# EasyEDA Pro project ProPrj_Tuya AC Sensor_2025-06-06.epro

# Schematic Schematic1
Board Name: Board1; Create Date: 2025-06-05; Page Name: P1; Project Name: Tuya AC Sensor; Schematic Name: Schematic1; Update Date: 2025-06-05; Company: EasyEDA.com; Page Size: A4; Version: V1.0
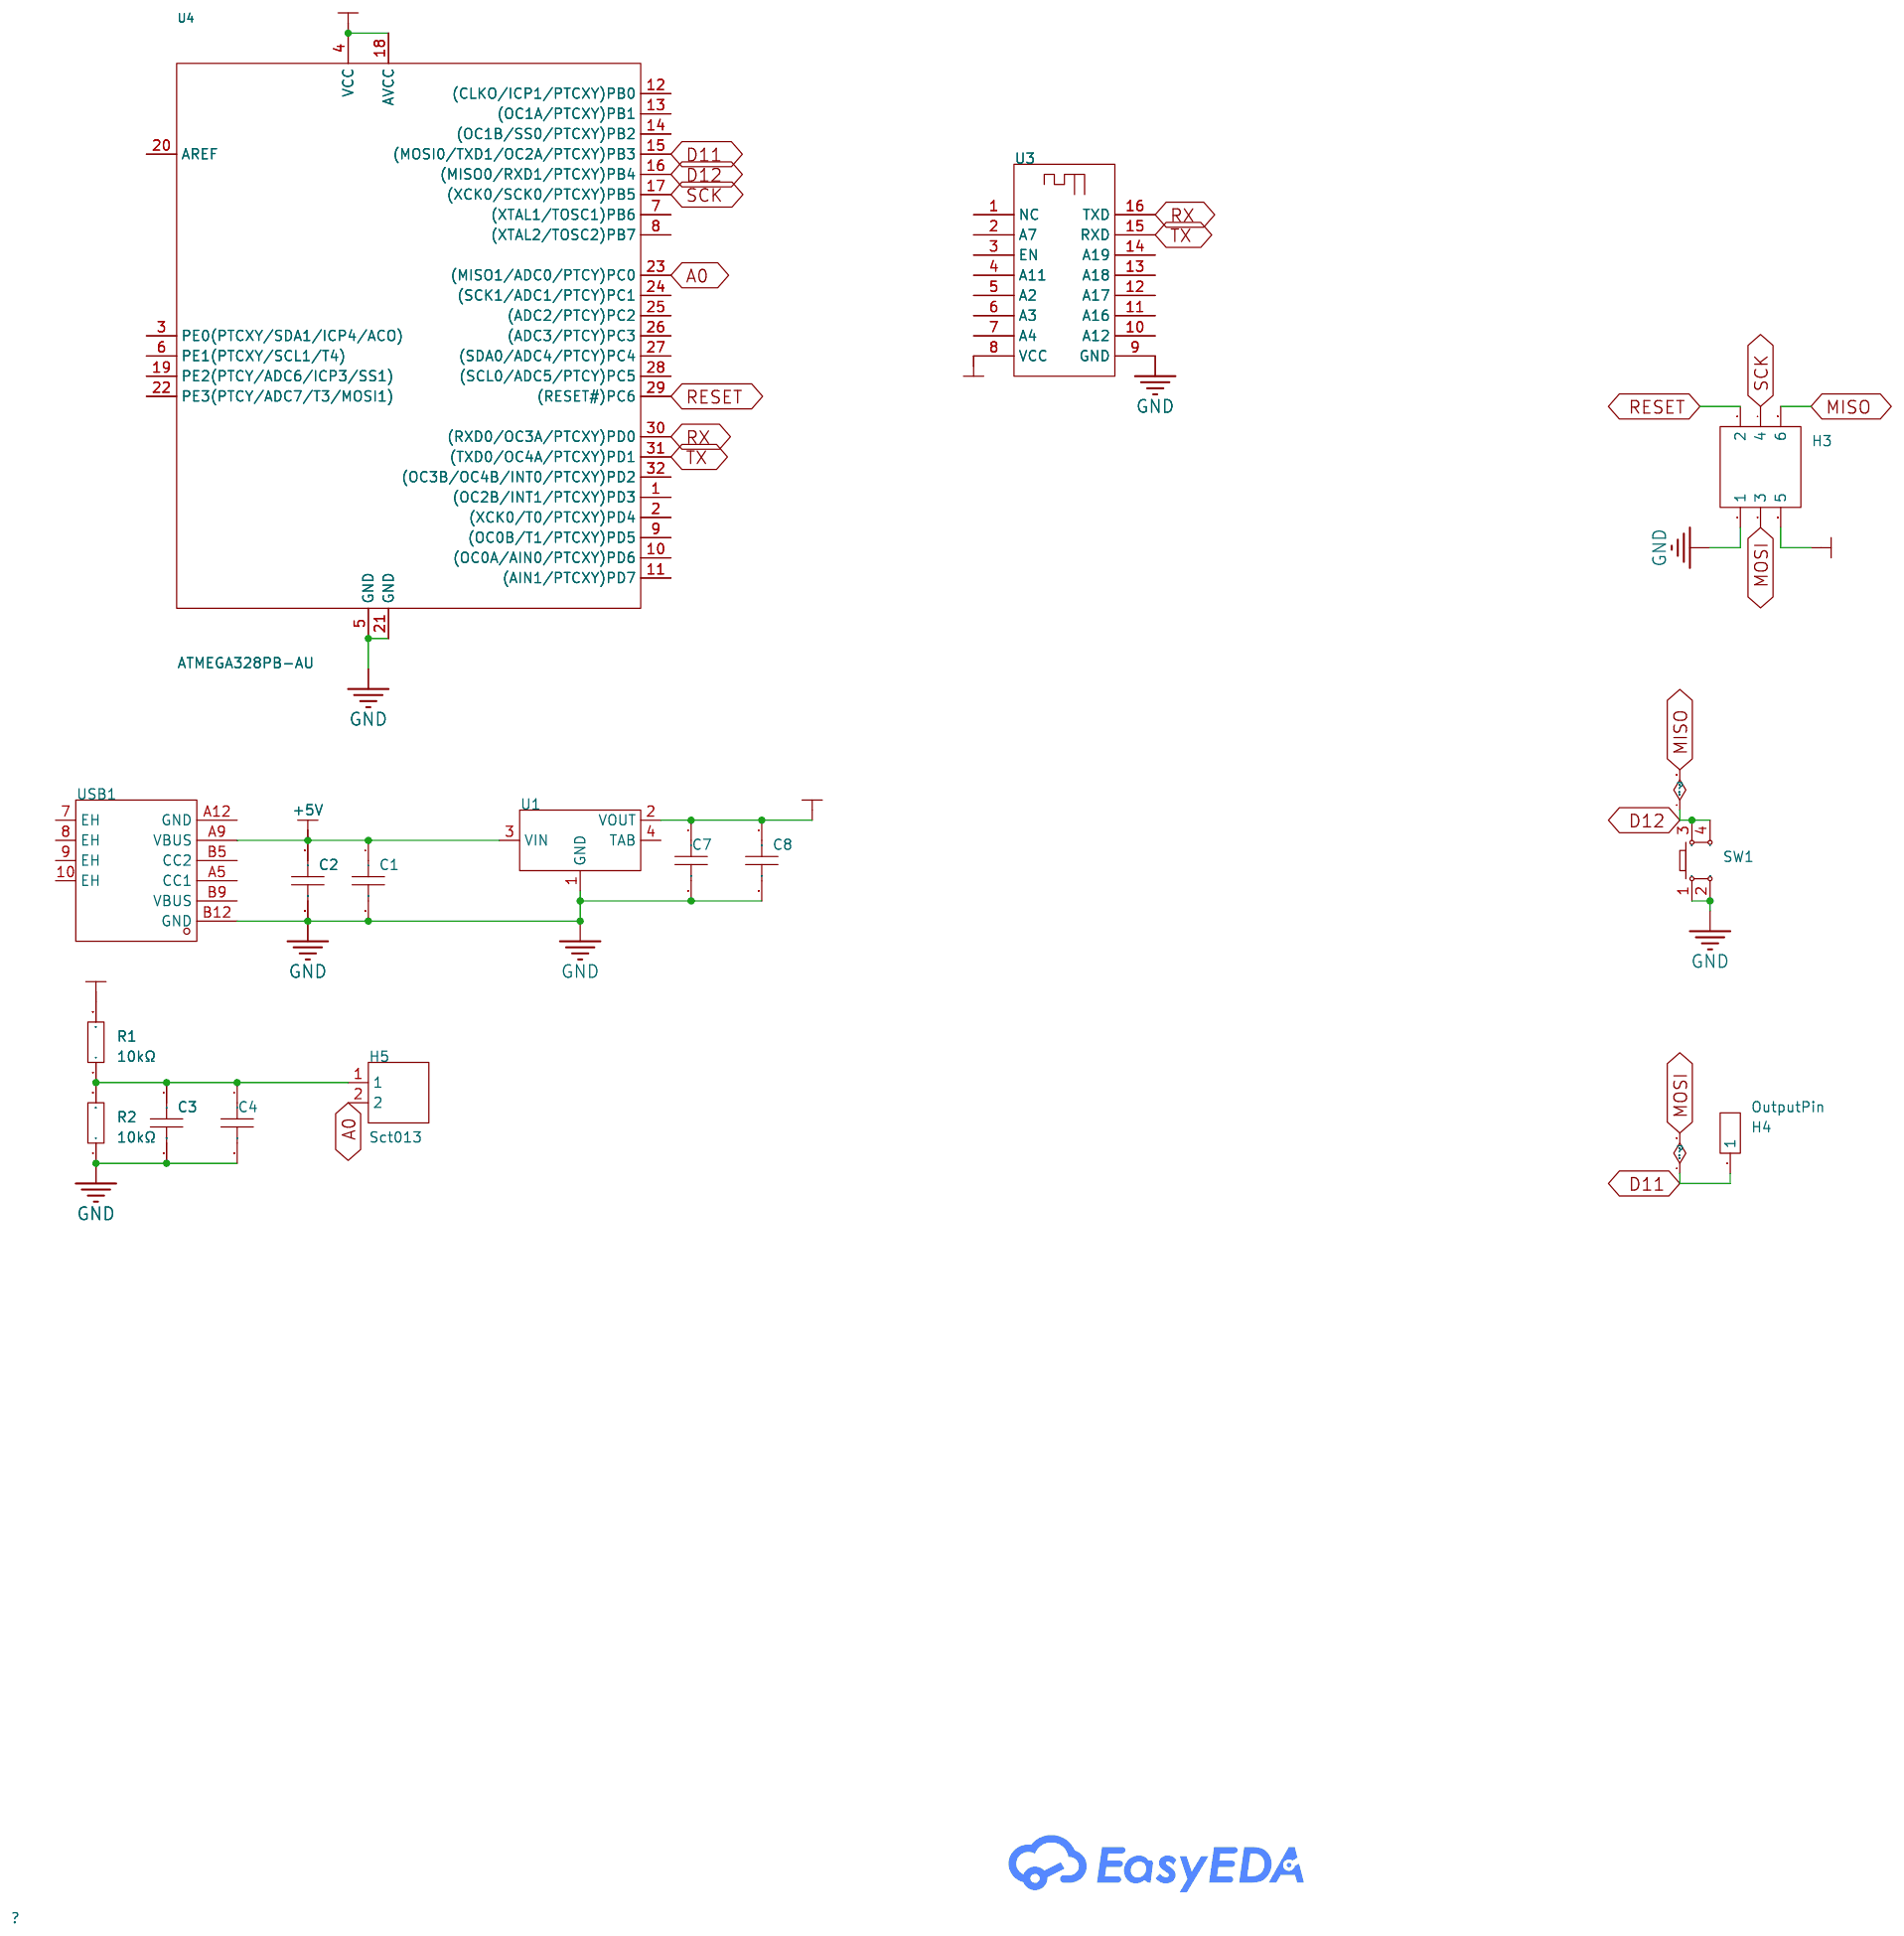
[diagram p0: schematic sheet]

## Parts
C1  100nF  [C0805]
C2  100nF  [C0805]
C3  100nF  [C0805]
C4  100nF  [C0805]
C7  100nF  [C0805]
C8  100nF  [C0805]
H3  -  [HDR-TH_6P-P2.54-V-R2-C3-S2.54_A2541WV-2X3P]
H4  OutputPin  [HDR-TH_1P-V-M_XKB_X4611WV-01I-C28D40]
H5  Sct013  [HDR-TH_2P-P2.54-V-M-1]
R1  10kΩ  [R1206]
R2  10kΩ  [R1206]
SW1  -  [KEY-TH_4P-L6.0-W6.0-P3.90-LS6.5]
U1  -  [SOT-223-4_L6.5-W3.5-P2.30-LS7.0-BR]
U3  -  [WBR3]
U4  ATMEGA328PB-AU  [TQFP-32_L7.0-W7.0-P0.80-LS9.0-BL]
USB1  -  [USB-SMD_U262-061N-4BVC11]

## Library data of the parts
C1-C4 C7 C8 = CAP_0805: Supplier Footprint: 0805
H3 = HDR-M_2.54_2x3: Supplier Footprint: Through
H4 = HDR-M_2.54_1x1P: Supplier Footprint: Through
H5 = HDR-M_2.54_1x2P: Supplier Footprint: Through
R1 R2 = Res_1206: Supplier Footprint: 1206
SW1 = Key_TH_6x6x4.5: Supplier Footprint: Through
U1 = AMS1117-3.3V: Supplier Footprint: SOT-223
U3 = WBR3
U4 = ATMEGA328PB-AU: CPU Core:AVR CPU Maximum Speed:20MHz Program Storage Size:32KB Program Memory Type:FLASH Number of I/O:27 ADC (Bit):10bit Voltage - Supply:1.8V~5.5V Voltage - Supply:1.8V~5.5V Applications:-; Supplier Part: C132230; Manufacturer: MICROCHIP(美国微芯); Supplier Footprint: TQFP-32(7x7); JLCPCB Part Class: Extended Part; Datasheet: https://atta.szlcsc.com/upload/public/pdf/source/20180613/C194192_8D5429A154CB618E2C039489BC28712B.pdf; Supplier: LCSC; CPU Core: AVR; CPU Maximum Speed: 20MHz; Program Storage Size: 32KB; Program Memory Type: FLASH; Number of I/O: 27; ADC (Bit): 10bit; Voltage - Supply: 1.8V~5.5V
USB1 = USB_ TYPE-C-6P: Supplier Footprint: Through

## Nets
+3V3: C7.1 C8.1 H3.5 R1.2 U1.2(VOUT) U3.8(VCC) U4.4(VCC) U4.18(AVCC)
+5V: C1.1 C2.1 U1.3(VIN) USB1.A9(VBUS)
GND: C1.2 C2.2 C3.2 C4.2 C7.2 C8.2 H3.1 R2.1 SW1.1 SW1.2 U1.1(GND) U3.9(GND) U4.5(GND) U4.21(GND) USB1.B12(GND)
A0: H5.2 U4.23((MISO1/ADC0/PTCY)PC0)
D11: H3.3 H4.1 U4.15((MOSI0/TXD1/OC2A/PTCXY)PB3)
D12: H3.6 SW1.3 SW1.4 U4.16((MISO0/RXD1/PTCXY)PB4)
RESET: H3.2 U4.29((RESET#)PC6)
RX: U3.16(TXD) U4.30((RXD0/OC3A/PTCXY)PD0)
SCK: H3.4 U4.17((XCK0/SCK0/PTCXY)PB5)
TX: U3.15(RXD) U4.31((TXD0/OC4A/PTCXY)PD1)
Net-(C3-1): C3.1 C4.1 H5.1 R1.1 R2.2

Not connected (* = marked no-connect by the designer): U1 4(TAB); U3 1(NC) 2(A7) 3(EN) 4(A11) 5(A2) 6(A3) 7(A4) 10(A12) 11(A16) 12(A17) 13(A18) 14(A19); U4 1((OC2B/INT1/PTCXY)PD3) 2((XCK0/T0/PTCXY)PD4) 3(PE0(PTCXY/SDA1/ICP4/ACO)) 6(PE1(PTCXY/SCL1/T4)) 7((XTAL1/TOSC1)PB6) 8((XTAL2/TOSC2)PB7) 9((OC0B/T1/PTCXY)PD5) 10((OC0A/AIN0/PTCXY)PD6) 11((AIN1/PTCXY)PD7) 12((CLKO/ICP1/PTCXY)PB0) 13((OC1A/PTCXY)PB1) 14((OC1B/SS0/PTCXY)PB2) 19(PE2(PTCY/ADC6/ICP3/SS1)) 20(AREF) 22(PE3(PTCY/ADC7/T3/MOSI1)) 24((SCK1/ADC1/PTCY)PC1) 25((ADC2/PTCY)PC2) 26((ADC3/PTCY)PC3) 27((SDA0/ADC4/PTCY)PC4) 28((SCL0/ADC5/PTCY)PC5) 32((OC3B/OC4B/INT0/PTCXY)PD2); USB1 7(EH) 8(EH) 9(EH) 10(EH) A5(CC1) A12(GND) B5(CC2) B9(VBUS)

# Schematic Schematic2
Board Name: WithModules; Create Date: 2025-06-06; Page Name: P1; Project Name: Tuya AC Sensor; Schematic Name: Schematic2; Update Date: 2025-06-06; Company: EasyEDA.com; Page Size: A4; Version: V1.0
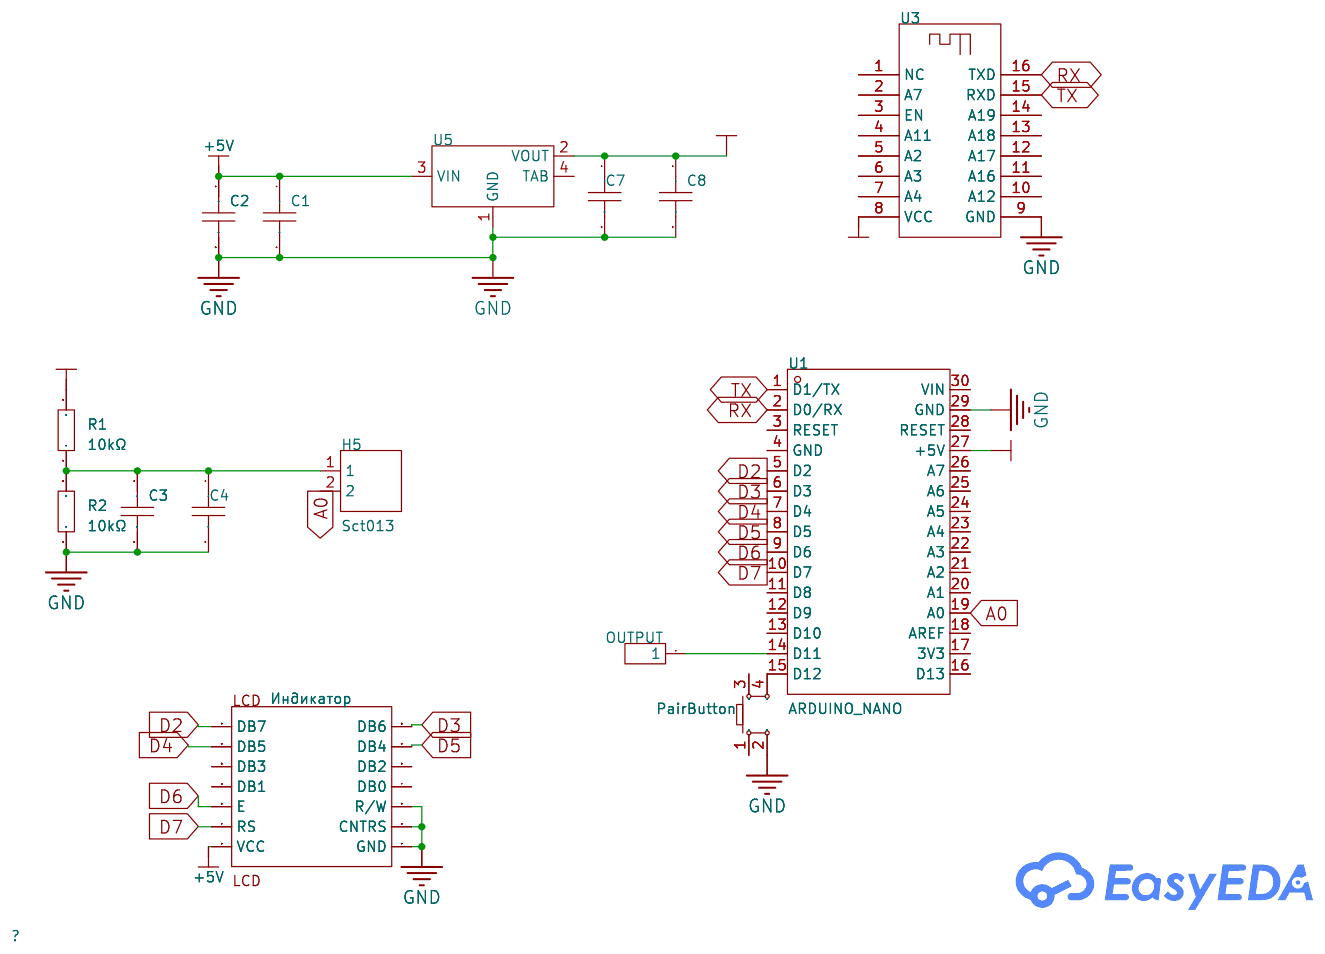
[diagram p1: schematic sheet]

## Parts
C1  100nF  [C0805]
C2  100nF  [C0805]
C3  100nF  [C0805]
C4  100nF  [C0805]
C7  100nF  [C0805]
C8  100nF  [C0805]
H5  Sct013  [HDR-TH_2P-P2.54-V-M-1]
OUTPUT  -  [HDR-TH_1P-V-M_XKB_X4611WV-01I-C28D40]
PairButton  -  [KEY-TH_4P-L6.0-W6.0-P3.90-LS6.5]
R1  10kΩ  [R1206]
R2  10kΩ  [R1206]
U1  ARDUINO_NANO  [COMM-TH_ARDUINO_NANO]
U3  -  [WBR3]
U5  -  [SOT-223-4_L6.5-W3.5-P2.30-LS7.0-BR]
Индикатор  -  [0802lcd]

## Library data of the parts
C1-C4 C7 C8 = CAP_0805: Supplier Footprint: 0805
H5 = HDR-M_2.54_1x2P: Supplier Footprint: Through
OUTPUT = HDR-M_2.54_1x1P: Supplier Footprint: Through
PairButton = Key_TH_6x6x4.5: Supplier Footprint: Through
R1 R2 = Res_1206: Supplier Footprint: 1206
U1 = ARDUINO_NANO: Supplier Part: C9900017879; Supplier Footprint: 插件; Supplier: LCSC
U3 = WBR3
U5 = AMS1117-3.3V: Supplier Footprint: SOT-223
Индикатор = lcd0802

## Nets
+3V3: C7.1 C8.1 R1.2 U1.27(+5V) U3.8(VCC) U5.2(VOUT)
+5V: C1.1 C2.1 U5.3(VIN) Индикатор.2(VCC)
GND: C1.2 C2.2 C3.2 C4.2 C7.2 C8.2 PairButton.2 R2.1 U1.29(GND) U3.9(GND) U5.1(GND) Индикатор.1(GND) Индикатор.3(CNTRS) Индикатор.5(R/W)
A0: H5.2 U1.19(A0)
D2: U1.5(D2) Индикатор.14(DB7)
D3: U1.6(D3) Индикатор.13(DB6)
D4: U1.7(D4) Индикатор.12(DB5)
D5: U1.8(D5) Индикатор.11(DB4)
D6: U1.9(D6) Индикатор.6(E)
D7: U1.10(D7) Индикатор.4(RS)
RX: U1.2(D0/RX) U3.16(TXD)
TX: U1.1(D1/TX) U3.15(RXD)
Net-(C3-1): C3.1 C4.1 H5.1 R1.1 R2.2
Net-(OUTPUT-1): OUTPUT.1 U1.14(D11)
Net-(PairButton-4): PairButton.4 U1.15(D12)

Not connected (* = marked no-connect by the designer): PairButton 1 3; U1 3(RESET) 4(GND) 11(D8) 12(D9) 13(D10) 16(D13) 17(3V3) 18(AREF) 20(A1) 21(A2) 22(A3) 23(A4) 24(A5) 25(A6) 26(A7) 28(RESET) 30(VIN); U3 1(NC) 2(A7) 3(EN) 4(A11) 5(A2) 6(A3) 7(A4) 10(A12) 11(A16) 12(A17) 13(A18) 14(A19); U5 4(TAB); Индикатор 7(DB0) 8(DB1) 9(DB2) 10(DB3)

# Board PCB1
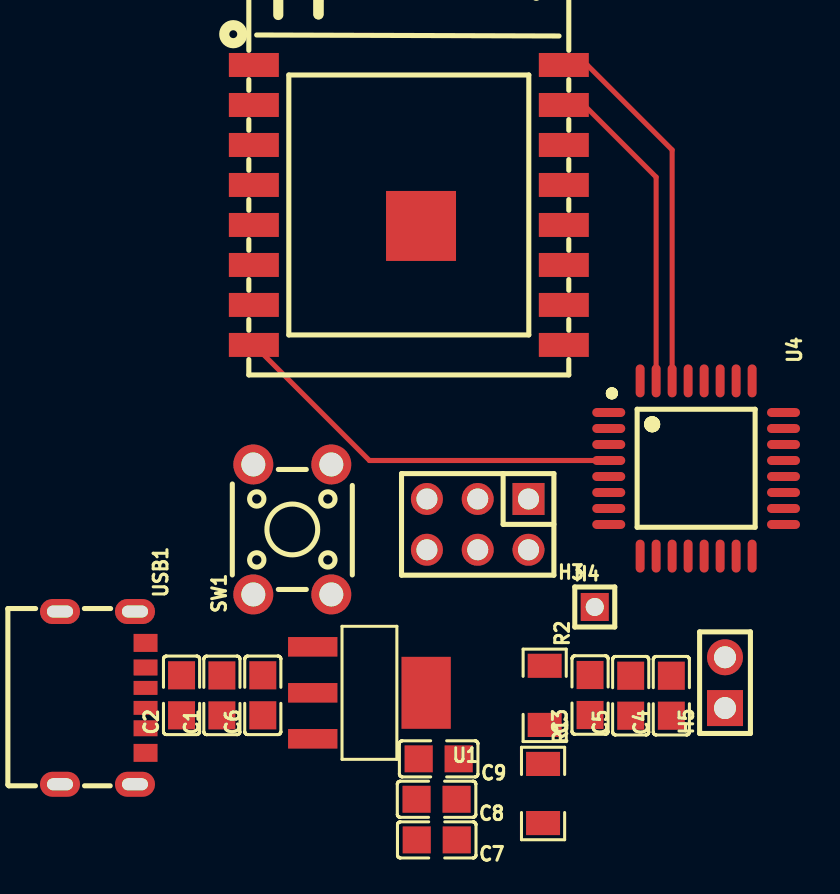
[diagram p2: board, top side]
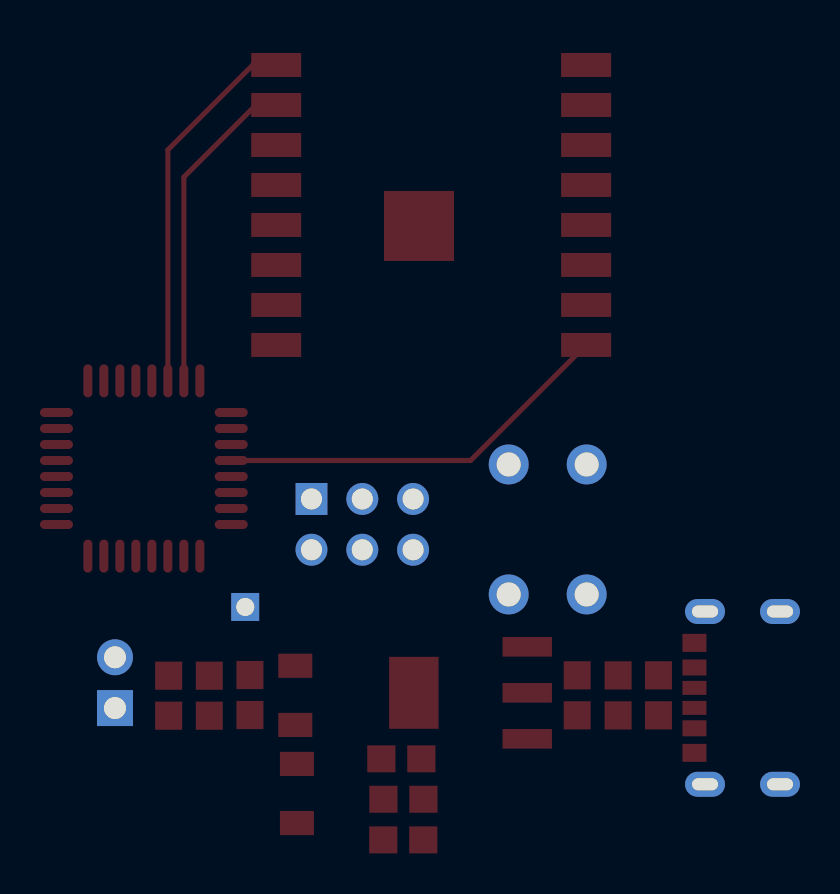
[diagram p3: board, bottom side, seen from below]

No outline. copper layers: Top Layer, Bottom Layer. Coordinates in mm from the lowest, leftmost part position.
Stack: Top Layer 0.035mm / Dielectric1 1.51mm FR4 er 4.5 / Bottom Layer 0.035mm

## Design rules (mm)
template: JLCPCB Capability(Two Layers Board)
spacing copperThickness1oz (default): track to track 0.102, other pairs 0.152 to 0.3
spacing copperThickness2oz: track to track 0.203, other pairs 0.152 to 0.3
track width copperThickness1oz (default): min 0.127, default 0.254, max 2.54
track width copperThickness2oz: min 0.203, default 0.254, max 2.54
differential pair differentialPair (default): width min 0.127, default 0.254, max 2.54; gap min 0.152, default 0.152
via viaSize (default): diameter min 0.5, default 0.61, max 10; hole min 0.3, default 0.305, max 6.3

## Placement (name value [footprint] x y rotation side)
C1  100nF  [C0805]  5.96 7.23 90 top
C2  100nF  [C0805]  3.94 7.23 90 top
C3  100nF  [C0805]  24.37 7.25 90 top
C4  100nF  [C0805]  28.43 7.21 90 top
C5  100nF  [C0805]  26.4 7.21 90 top
C6  100nF  [C0805]  8 7.23 90 top
C7  100nF  [C0805]  16.7 0 180 top
C8  100nF  [C0805]  16.69 2.03 180 top
C9  100nF  [C0805]  16.8 4.05 180 top
H3  -  [HDR-TH_6P-P2.54-V-R2-C3-S2.54_A2541WV-2X3P]  18.75 15.78 180 top
H4  OutputPin  [HDR-TH_1P-V-M_XKB_X4611WV-01I-C28D40]  24.6 11.65 0 top
H5  Sct013  [HDR-TH_2P-P2.54-V-M-1]  31.12 7.86 90 top
R1  10kΩ  [R1206]  22.02 2.32 270 top
R2  10kΩ  [R1206]  22.1 7.23 270 top
SW1  -  [KEY-TH_4P-L6.0-W6.0-P3.90-LS6.5]  9.48 15.53 90 top
U1  -  [SOT-223-4_L6.5-W3.5-P2.30-LS7.0-BR]  13.34 7.36 180 top
U3  -  [WBR3]  15.13 31.75 0 top
U4  ATMEGA328PB-AU  [TQFP-32_L7.0-W7.0-P0.80-LS9.0-BL]  29.67 18.57 270 top
USB1  -  [USB-SMD_U262-061N-4BVC11]  0 7.1 270 top

## Footprints (pads in the part's own frame, mm; a bottom-side part is the same pattern mirrored in y, then rotated)
C0805
  rect 1.41x1.35 smd: 1(-1,0) 2(1,0)
HDR-TH_1P-V-M_XKB_X4611WV-01I-C28D40
  rect 1.4x1.4 hole 0.9: 1(0,0)
HDR-TH_2P-P2.54-V-M-1
  rect 1.8x1.8 hole 1.1: 1(-1.27,0)
  round 1.8 hole 1.1: 2(1.27,0)
HDR-TH_6P-P2.54-V-R2-C3-S2.54_A2541WV-2X3P
  rect 1.6x1.6 hole 1.05: 1(-2.54,-1.27)
  round 1.6 hole 1.05: 2(-2.54,1.27) 3(0,-1.27) 4(0,1.27) 5(2.54,-1.27) 6(2.54,1.27)
KEY-TH_4P-L6.0-W6.0-P3.90-LS6.5
  round 2 hole 1.2: 1(-3.25,1.95) 2(3.25,1.95) 3(-3.25,-1.95) 4(3.25,-1.95)
R1206
  rect 1.208x1.701 smd: 1(-1.479,0) 2(1.479,0)
SOT-223-4_L6.5-W3.5-P2.30-LS7.0-BR
  rect 2.47x0.98 smd: 1(2.835,-2.3) 2(2.835,0) 3(2.835,2.3)
  rect 2.47x3.6 smd: 4(-2.835,0)
TQFP-32_L7.0-W7.0-P0.80-LS9.0-BL
  oval 0.45x1.65 smd: 1(-2.8,-4.369) 2(-2,-4.369) 3(-1.2,-4.369) 4(-0.4,-4.369) 5(0.4,-4.369) 6(1.2,-4.369) 7(2,-4.369) 8(2.8,-4.369) 17(2.8,4.369) 18(2,4.369) 19(1.2,4.369) 20(0.4,4.369) 21(-0.4,4.369) 22(-1.2,4.369) 23(-2,4.369) 24(-2.8,4.369)
  oval 1.65x0.45 smd: 9(4.381,-2.8) 10(4.381,-2) 11(4.381,-1.2) 12(4.381,-0.4) 13(4.381,0.4) 14(4.381,1.2) 15(4.381,2) 16(4.381,2.8) 25(-4.381,2.8) 26(-4.381,2) 27(-4.381,1.2) 28(-4.381,0.4) 29(-4.381,-0.4) 30(-4.381,-1.2) 31(-4.381,-2) 32(-4.381,-2.8)
USB-SMD_U262-061N-4BVC11
  oval 1.25x2 hole 0.6x1.3: 7(-4.32,1.611) 8(4.32,1.611) 9(-4.32,-2.139) 10(4.32,-2.139)
  rect 0.7x1.2 smd: A5(-0.5,2.139) B5(0.5,2.139)
  rect 0.8x1.2 smd: A9(1.52,2.139) B9(-1.52,2.139)
  rect 0.9x1.2 smd: A12(2.75,2.139) B12(-2.75,2.139)
WBR3
  rect 2.499x1.2 smd: 1(-7.574,7)
  rect 2.5x1.2 smd: 2(-7.575,5) 3(-7.575,3) 4(-7.575,1) 5(-7.575,-1) 6(-7.575,-3) 7(-7.575,-5) 8(-7.575,-7) 9(7.925,-7) 10(7.925,-5) 11(7.925,-3) 12(7.925,-1) 13(7.925,1) 14(7.925,3) 15(7.925,5) 16(7.925,7)
  rect 3.5x3.5 smd: 17(0.784,-1.05)

## Nets
+3V3: C7.1 C8.1 C9.1 H3.5 R1.2 U1.2 U3.8 U4.4 U4.18
+5V: C1.1 C2.1 C6.1 U1.3 USB1.A9
GND: C1.2 C2.2 C3.2 C4.2 C5.2 C6.2 C7.2 C8.2 C9.2 H3.1 R2.1 SW1.1 SW1.2 U1.1 U3.9 U4.5 U4.21 USB1.B12
A0: H5.2 U4.23
D11: H3.3 H4.1 U4.15
D12: H3.6 SW1.3 SW1.4 U4.16
RESET: H3.2 U4.29
RX: U3.16 U4.30
SCK: H3.4 U4.17
TX: U3.15 U4.31
$1N1004: C3.1 C4.1 C5.1 H5.1 R1.1 R2.2

Pads without a net: U1 4; U3 1 2 3 4 5 6 7 10 11 12 13 14 17; U4 1 2 3 6 7 8 9 10 11 12 13 14 19 20 22 24 25 26 27 28 32; USB1 7 8 9 10 A5 A12 B5 B9

## Routing (per net, layer and track width the routed paths; a pad name or vN(x,y) marks a point on that pad's centre or on a via; arc(x,y) is an arc through that point)
+3V3: length 20.1
  Top Layer w0.254: U4.4 13.33,18.97 U3.8
RX: length 18.7
  Top Layer w0.254: U3.16 23.07,38.77 23.08,38.75 24.22,38.75 28.47,34.5 U4.30
TX: length 16.3
  Top Layer w0.254: U4.31 27.67,33.15 24.06,36.75 U3.15
